# Altium schematic sheet Conn_B.SchDoc
size A1
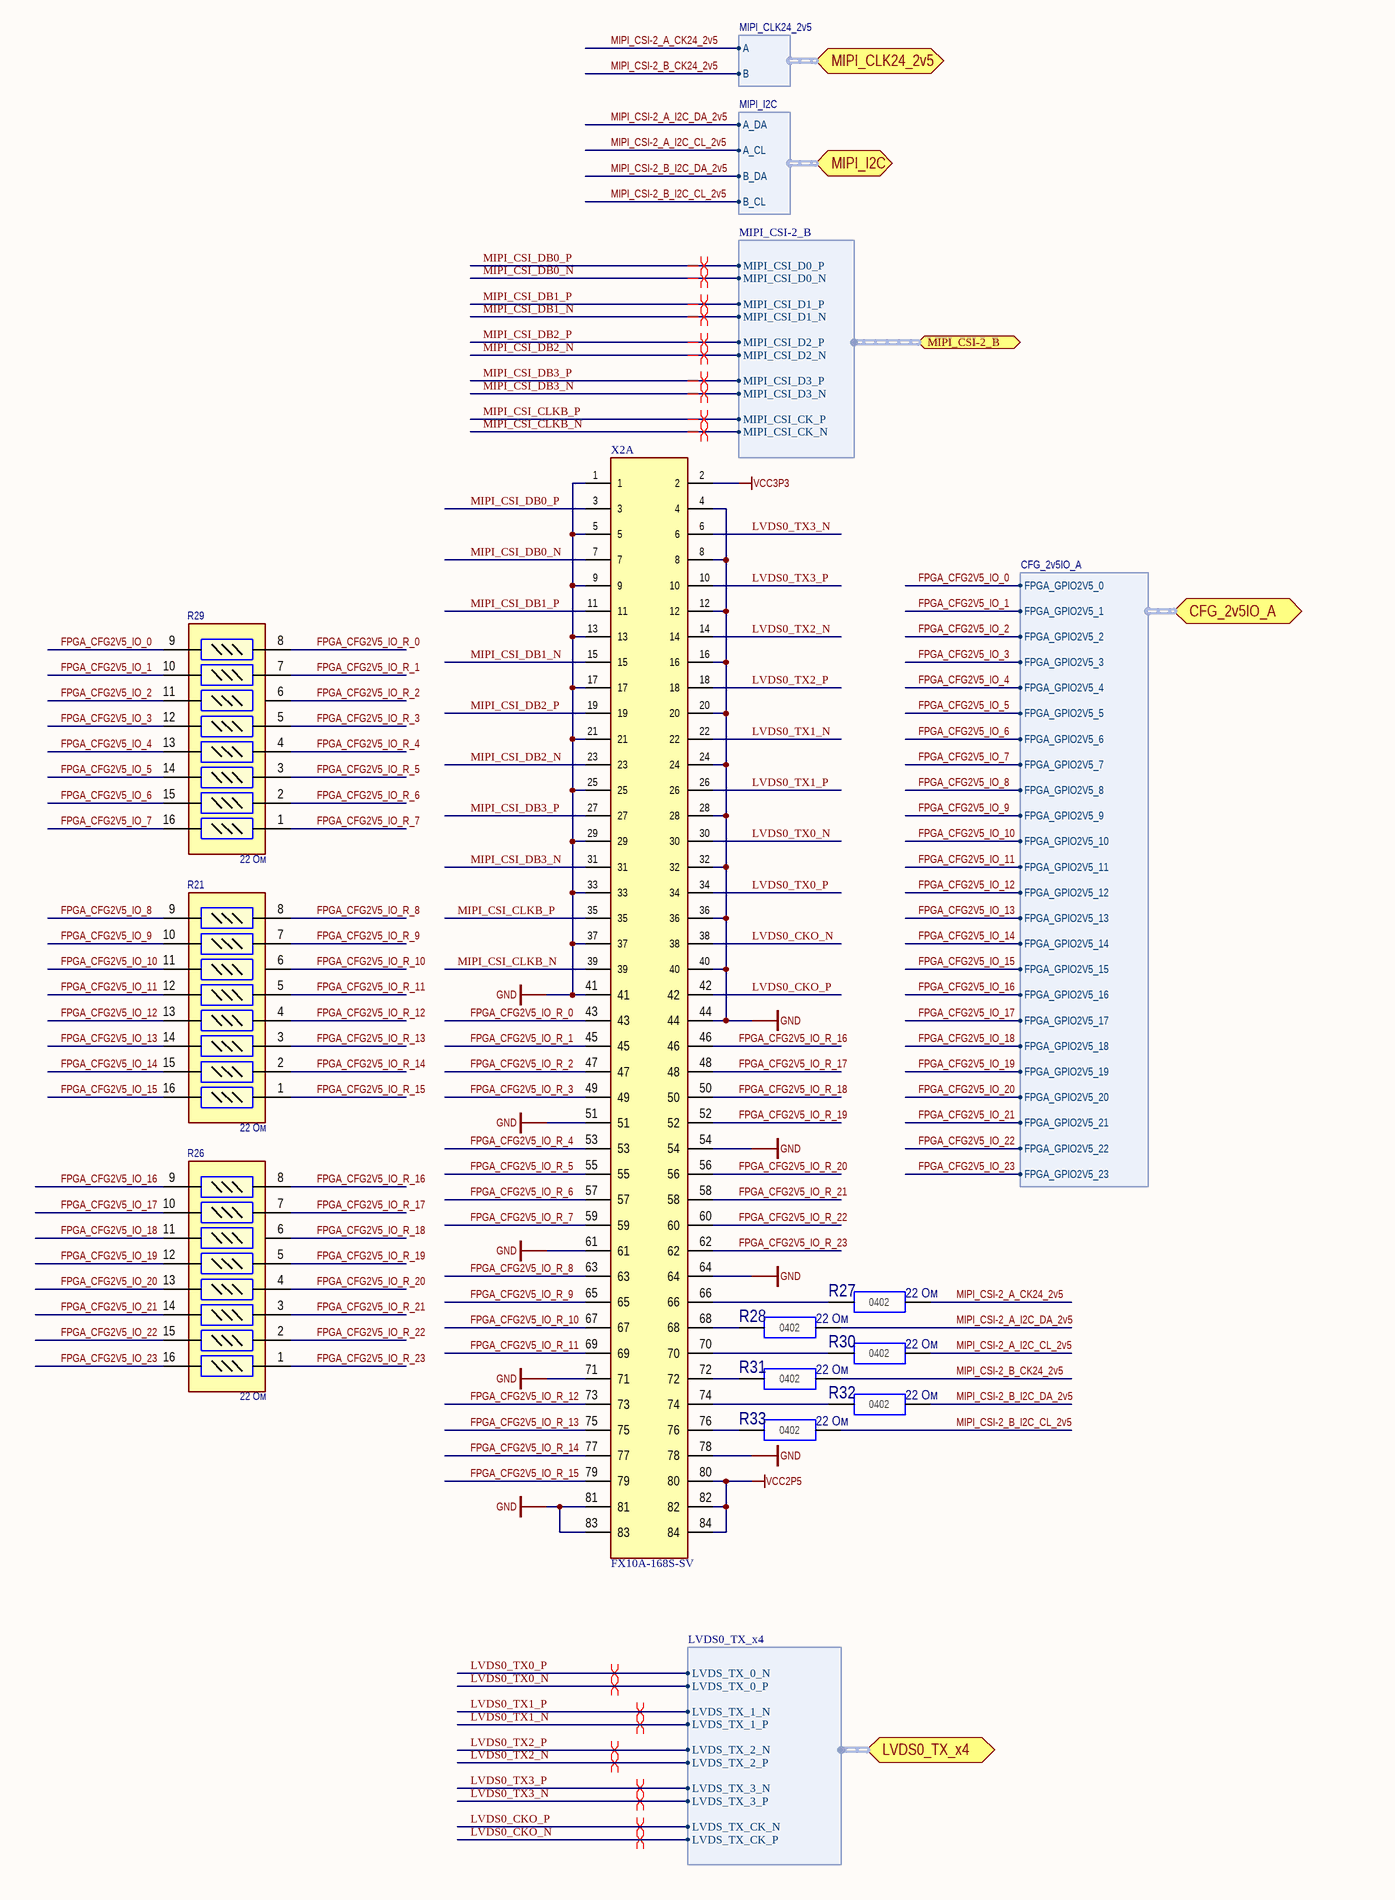
[diagram p0: Conn_B.SchDoc, left]
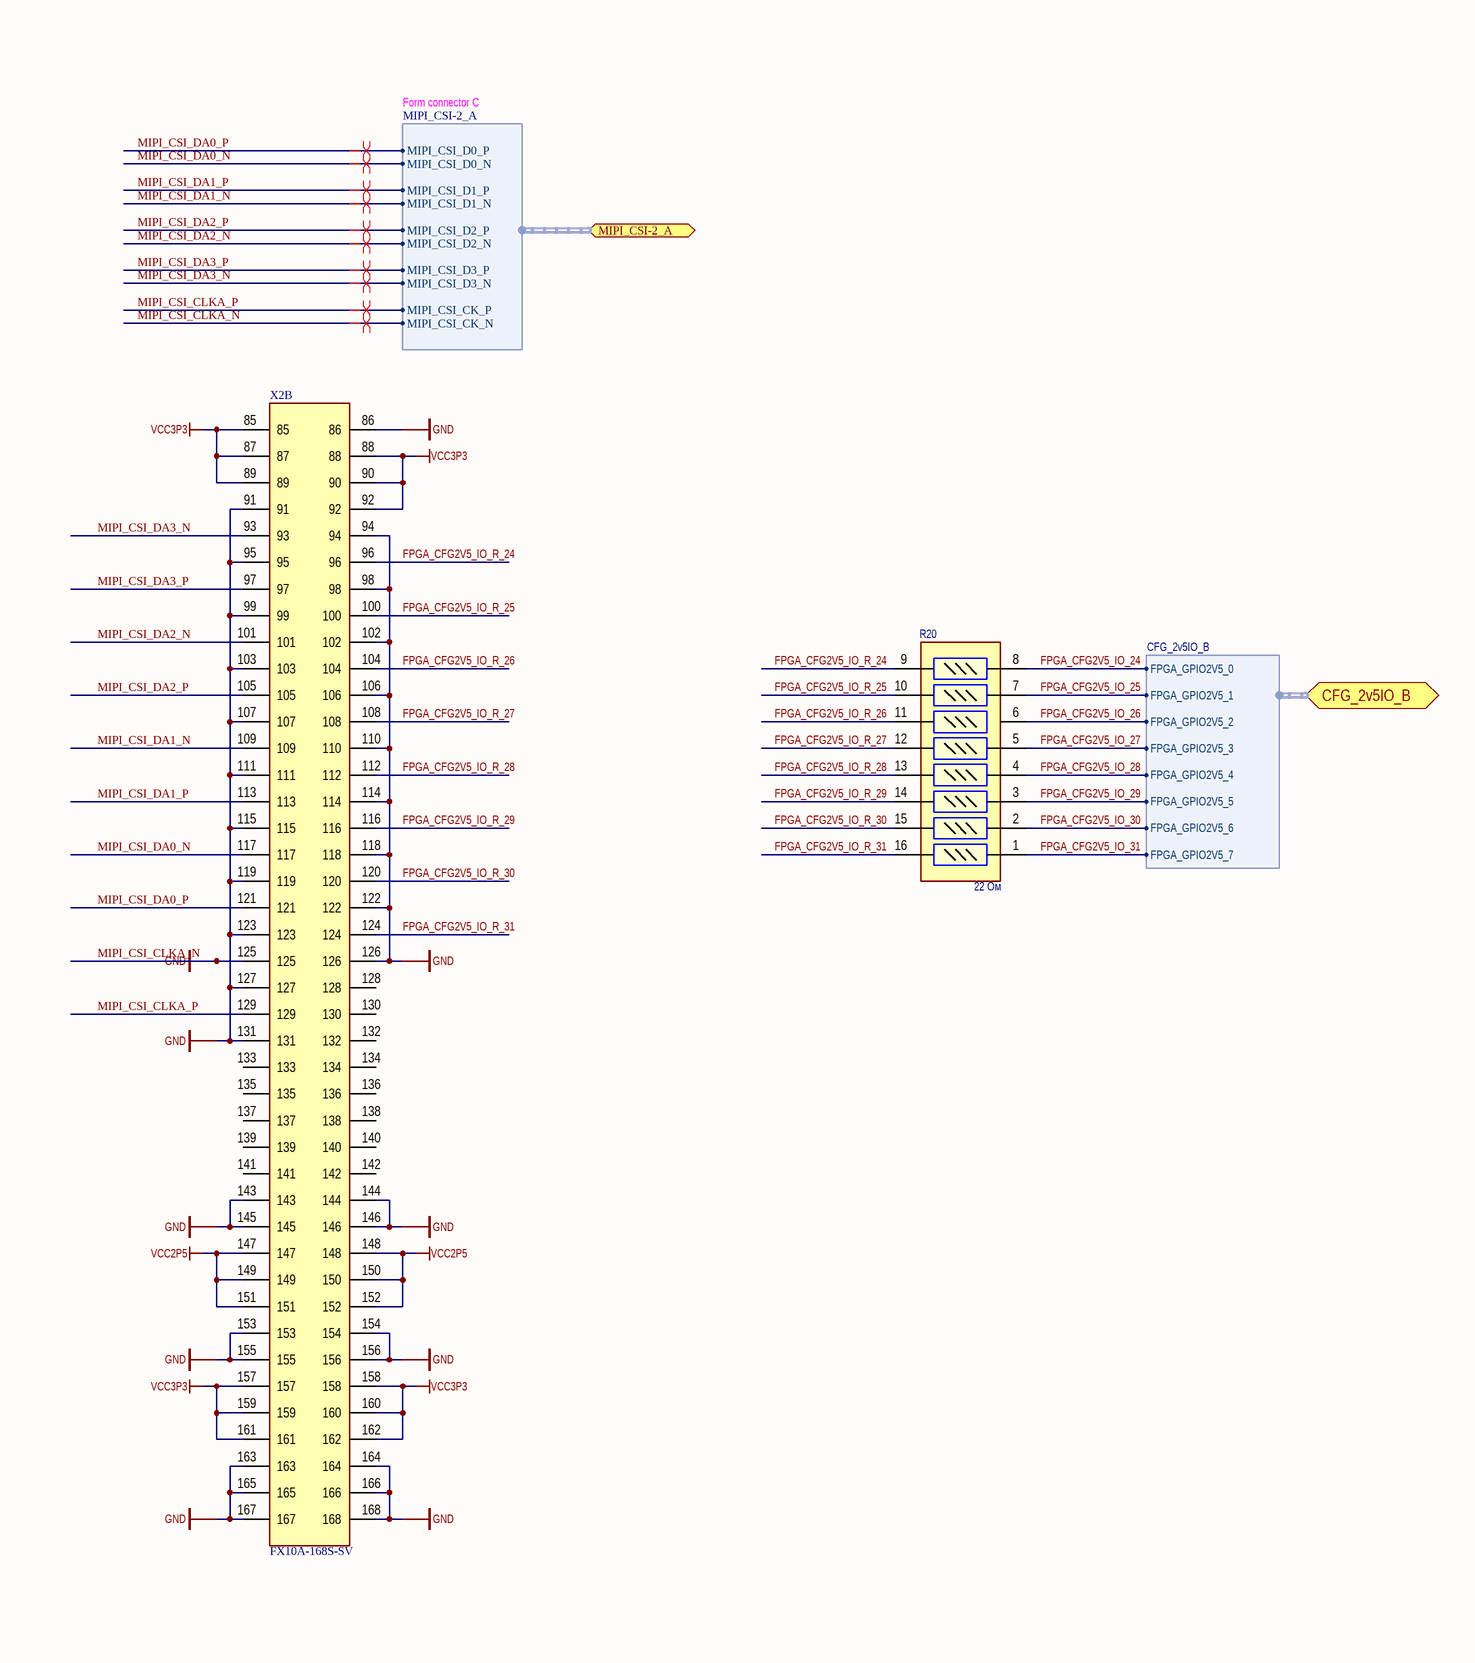
[diagram p1: Conn_B.SchDoc, right]

## Parts
R20  value 22 Ом  [CAT16-J8]  (hidden comment: YC248-JR-07-22 Ом)
R21  value 22 Ом  [CAT16-J8]  (hidden comment: YC248-JR-07-22 Ом)
R26  value 22 Ом  [CAT16-J8]  (hidden comment: YC248-JR-07-22 Ом)
R27  value 22 Ом  [CR0402(1005)]  (hidden comment: CR0402-22 Ом-±5%)
R28  value 22 Ом  [CR0402(1005)]  (hidden comment: CR0402-22 Ом-±5%)
R29  value 22 Ом  [CAT16-J8]  (hidden comment: YC248-JR-07-22 Ом)
R30  value 22 Ом  [CR0402(1005)]  (hidden comment: CR0402-22 Ом-±5%)
R31  value 22 Ом  [CR0402(1005)]  (hidden comment: CR0402-22 Ом-±5%)
R32  value 22 Ом  [CR0402(1005)]  (hidden comment: CR0402-22 Ом-±5%)
R33  value 22 Ом  [CR0402(1005)]  (hidden comment: CR0402-22 Ом-±5%)
X2  FX10A-168S-SV  [FX10A-168S-SV]  (parts A,B of 2)

## Ports
CFG_2v5IO_A (harness CFG_2v5IO_A), CFG_2v5IO_B (harness CFG_2v5IO_B), LVDS0_TX_x4 (harness LVDS0_TX_x4), MIPI_CLK24_2v5 (harness MIPI_CLK24_2v5), MIPI_CSI-2_A (harness MIPI_CSI-2_A), MIPI_CSI-2_B (harness MIPI_CSI-2_B), MIPI_I2C (harness MIPI_I2C)

## Harnesses
MIPI_CSI-2_A: MIPI_CSI_D0_N, MIPI_CSI_D0_P, MIPI_CSI_D1_N, MIPI_CSI_D1_P, MIPI_CSI_D2_P, MIPI_CSI_D2_N, MIPI_CSI_D3_N, MIPI_CSI_D3_P, MIPI_CSI_CK_N, MIPI_CSI_CK_P
MIPI_CSI-2_B: MIPI_CSI_D0_N, MIPI_CSI_D0_P, MIPI_CSI_D1_N, MIPI_CSI_D1_P, MIPI_CSI_D2_P, MIPI_CSI_D2_N, MIPI_CSI_D3_N, MIPI_CSI_D3_P, MIPI_CSI_CK_N, MIPI_CSI_CK_P
LVDS0_TX_x4: LVDS_TX_0_P, LVDS_TX_0_N, LVDS_TX_1_P, LVDS_TX_1_N, LVDS_TX_2_P, LVDS_TX_2_N, LVDS_TX_3_P, LVDS_TX_3_N, LVDS_TX_CK_P, LVDS_TX_CK_N
MIPI_CLK24_2v5: A, B
MIPI_I2C: A_DA, A_CL, B_DA, B_CL
CFG_2v5IO_A: FPGA_GPIO2V5_0, FPGA_GPIO2V5_1, FPGA_GPIO2V5_2, FPGA_GPIO2V5_3, FPGA_GPIO2V5_4, FPGA_GPIO2V5_5, FPGA_GPIO2V5_6, FPGA_GPIO2V5_7, FPGA_GPIO2V5_8, FPGA_GPIO2V5_9, FPGA_GPIO2V5_10, FPGA_GPIO2V5_11, FPGA_GPIO2V5_12, FPGA_GPIO2V5_13, FPGA_GPIO2V5_14, FPGA_GPIO2V5_15, FPGA_GPIO2V5_16, FPGA_GPIO2V5_17, FPGA_GPIO2V5_18, FPGA_GPIO2V5_19, FPGA_GPIO2V5_20, FPGA_GPIO2V5_21, FPGA_GPIO2V5_22, FPGA_GPIO2V5_23
CFG_2v5IO_B: FPGA_GPIO2V5_0, FPGA_GPIO2V5_1, FPGA_GPIO2V5_2, FPGA_GPIO2V5_3, FPGA_GPIO2V5_4, FPGA_GPIO2V5_5, FPGA_GPIO2V5_6, FPGA_GPIO2V5_7

## Nets
MIPI_CSI_CLKA_N: X2.1 X2.4 X2.5 X2.8 X2.9 X2.12 X2.13 X2.16 X2.17 X2.20 X2.21 X2.24 X2.25 X2.28 X2.29 X2.32 X2.33 X2.36 X2.37 X2.40 X2.41 X2.44 X2.51 X2.54 X2.61 X2.64 X2.71 X2.78 X2.81 X2.83 X2.86 X2.91 X2.94 X2.95 X2.98 X2.99 X2.102 X2.103 X2.106 X2.107 X2.110 X2.111 X2.114 X2.115 X2.118 X2.119 X2.122 X2.123 X2.125 X2.126 X2.127 X2.131 X2.143 X2.144 X2.145 X2.146 X2.153 X2.154 X2.155 X2.156 X2.163 X2.164 X2.165 X2.166 X2.167 X2.168 ; port MIPI_CSI-2_A.MIPI_CSI_CK_N  [also labelled GND]
VCC2P5: X2.80 X2.82 X2.84 X2.147 X2.148 X2.149 X2.150 X2.151 X2.152
VCC3P3: X2.2 X2.85 X2.87 X2.88 X2.89 X2.90 X2.92 X2.157 X2.158 X2.159 X2.160 X2.161 X2.162
FPGA_CFG2V5_IO_0: R29.9 ; port CFG_2v5IO_A.FPGA_GPIO2V5_0
FPGA_CFG2V5_IO_1: R29.10 ; port CFG_2v5IO_A.FPGA_GPIO2V5_1
FPGA_CFG2V5_IO_2: R29.11 ; port CFG_2v5IO_A.FPGA_GPIO2V5_2
FPGA_CFG2V5_IO_3: R29.12 ; port CFG_2v5IO_A.FPGA_GPIO2V5_3
FPGA_CFG2V5_IO_4: R29.13 ; port CFG_2v5IO_A.FPGA_GPIO2V5_4
FPGA_CFG2V5_IO_5: R29.14 ; port CFG_2v5IO_A.FPGA_GPIO2V5_5
FPGA_CFG2V5_IO_6: R29.15 ; port CFG_2v5IO_A.FPGA_GPIO2V5_6
FPGA_CFG2V5_IO_7: R29.16 ; port CFG_2v5IO_A.FPGA_GPIO2V5_7
FPGA_CFG2V5_IO_8: R21.9 ; port CFG_2v5IO_A.FPGA_GPIO2V5_8
FPGA_CFG2V5_IO_9: R21.10 ; port CFG_2v5IO_A.FPGA_GPIO2V5_9
FPGA_CFG2V5_IO_10: R21.11 ; port CFG_2v5IO_A.FPGA_GPIO2V5_10
FPGA_CFG2V5_IO_11: R21.12 ; port CFG_2v5IO_A.FPGA_GPIO2V5_11
FPGA_CFG2V5_IO_12: R21.13 ; port CFG_2v5IO_A.FPGA_GPIO2V5_12
FPGA_CFG2V5_IO_13: R21.14 ; port CFG_2v5IO_A.FPGA_GPIO2V5_13
FPGA_CFG2V5_IO_14: R21.15 ; port CFG_2v5IO_A.FPGA_GPIO2V5_14
FPGA_CFG2V5_IO_15: R21.16 ; port CFG_2v5IO_A.FPGA_GPIO2V5_15
FPGA_CFG2V5_IO_16: R26.9 ; port CFG_2v5IO_A.FPGA_GPIO2V5_16
FPGA_CFG2V5_IO_17: R26.10 ; port CFG_2v5IO_A.FPGA_GPIO2V5_17
FPGA_CFG2V5_IO_18: R26.11 ; port CFG_2v5IO_A.FPGA_GPIO2V5_18
FPGA_CFG2V5_IO_19: R26.12 ; port CFG_2v5IO_A.FPGA_GPIO2V5_19
FPGA_CFG2V5_IO_20: R26.13 ; port CFG_2v5IO_A.FPGA_GPIO2V5_20
FPGA_CFG2V5_IO_21: R26.14 ; port CFG_2v5IO_A.FPGA_GPIO2V5_21
FPGA_CFG2V5_IO_22: R26.15 ; port CFG_2v5IO_A.FPGA_GPIO2V5_22
FPGA_CFG2V5_IO_23: R26.16 ; port CFG_2v5IO_A.FPGA_GPIO2V5_23
FPGA_CFG2V5_IO_24: R20.8 ; port CFG_2v5IO_B.FPGA_GPIO2V5_0
FPGA_CFG2V5_IO_25: R20.7 ; port CFG_2v5IO_B.FPGA_GPIO2V5_1
FPGA_CFG2V5_IO_26: R20.6 ; port CFG_2v5IO_B.FPGA_GPIO2V5_2
FPGA_CFG2V5_IO_27: R20.5 ; port CFG_2v5IO_B.FPGA_GPIO2V5_3
FPGA_CFG2V5_IO_28: R20.4 ; port CFG_2v5IO_B.FPGA_GPIO2V5_4
FPGA_CFG2V5_IO_29: R20.3 ; port CFG_2v5IO_B.FPGA_GPIO2V5_5
FPGA_CFG2V5_IO_30: R20.2 ; port CFG_2v5IO_B.FPGA_GPIO2V5_6
FPGA_CFG2V5_IO_31: R20.1 ; port CFG_2v5IO_B.FPGA_GPIO2V5_7
FPGA_CFG2V5_IO_R_0: R29.8 X2.43
FPGA_CFG2V5_IO_R_1: R29.7 X2.45
FPGA_CFG2V5_IO_R_2: R29.6 X2.47
FPGA_CFG2V5_IO_R_3: R29.5 X2.49
FPGA_CFG2V5_IO_R_4: R29.4 X2.53
FPGA_CFG2V5_IO_R_5: R29.3 X2.55
FPGA_CFG2V5_IO_R_6: R29.2 X2.57
FPGA_CFG2V5_IO_R_7: R29.1 X2.59
FPGA_CFG2V5_IO_R_8: R21.8 X2.63
FPGA_CFG2V5_IO_R_9: R21.7 X2.65
FPGA_CFG2V5_IO_R_10: R21.6 X2.67
FPGA_CFG2V5_IO_R_11: R21.5 X2.69
FPGA_CFG2V5_IO_R_12: R21.4 X2.73
FPGA_CFG2V5_IO_R_13: R21.3 X2.75
FPGA_CFG2V5_IO_R_14: R21.2 X2.77
FPGA_CFG2V5_IO_R_15: R21.1 X2.79
FPGA_CFG2V5_IO_R_16: R26.8 X2.46
FPGA_CFG2V5_IO_R_17: R26.7 X2.48
FPGA_CFG2V5_IO_R_18: R26.6 X2.50
FPGA_CFG2V5_IO_R_19: R26.5 X2.52
FPGA_CFG2V5_IO_R_20: R26.4 X2.56
FPGA_CFG2V5_IO_R_21: R26.3 X2.58
FPGA_CFG2V5_IO_R_22: R26.2 X2.60
FPGA_CFG2V5_IO_R_23: R26.1 X2.62
FPGA_CFG2V5_IO_R_24: R20.9 X2.96
FPGA_CFG2V5_IO_R_25: R20.10 X2.100
FPGA_CFG2V5_IO_R_26: R20.11 X2.104
FPGA_CFG2V5_IO_R_27: R20.12 X2.108
FPGA_CFG2V5_IO_R_28: R20.13 X2.112
FPGA_CFG2V5_IO_R_29: R20.14 X2.116
FPGA_CFG2V5_IO_R_30: R20.15 X2.120
FPGA_CFG2V5_IO_R_31: R20.16 X2.124
LVDS0_CKO_N: X2.38 ; port LVDS0_TX_x4.LVDS_TX_CK_P
LVDS0_CKO_P: X2.42 ; port LVDS0_TX_x4.LVDS_TX_CK_N
LVDS0_TX0_N: X2.30 ; port LVDS0_TX_x4.LVDS_TX_0_P
LVDS0_TX0_P: X2.34 ; port LVDS0_TX_x4.LVDS_TX_0_N
LVDS0_TX1_N: X2.22 ; port LVDS0_TX_x4.LVDS_TX_1_P
LVDS0_TX1_P: X2.26 ; port LVDS0_TX_x4.LVDS_TX_1_N
LVDS0_TX2_N: X2.14 ; port LVDS0_TX_x4.LVDS_TX_2_P
LVDS0_TX2_P: X2.18 ; port LVDS0_TX_x4.LVDS_TX_2_N
LVDS0_TX3_N: X2.6 ; port LVDS0_TX_x4.LVDS_TX_3_P
LVDS0_TX3_P: X2.10 ; port LVDS0_TX_x4.LVDS_TX_3_N
MIPI_CSI-2_A_CK24_2v5: R27.2(-) ; port MIPI_CLK24_2v5.A
MIPI_CSI-2_A_I2C_CL_2v5: R30.2(-) ; port MIPI_I2C.A_CL
MIPI_CSI-2_A_I2C_DA_2v5: R28.2(-) ; port MIPI_I2C.A_DA
MIPI_CSI-2_B_CK24_2v5: R31.2(-) ; port MIPI_CLK24_2v5.B
MIPI_CSI-2_B_I2C_CL_2v5: R33.2(-) ; port MIPI_I2C.B_CL
MIPI_CSI-2_B_I2C_DA_2v5: R32.2(-) ; port MIPI_I2C.B_DA
MIPI_CSI_CLKA_P: X2.129 ; port MIPI_CSI-2_A.MIPI_CSI_CK_P
MIPI_CSI_CLKB_N: X2.39 ; port MIPI_CSI-2_B.MIPI_CSI_CK_N
MIPI_CSI_CLKB_P: X2.35 ; port MIPI_CSI-2_B.MIPI_CSI_CK_P
MIPI_CSI_DA0_N: X2.117 ; port MIPI_CSI-2_A.MIPI_CSI_D0_N
MIPI_CSI_DA0_P: X2.121 ; port MIPI_CSI-2_A.MIPI_CSI_D0_P
MIPI_CSI_DA1_N: X2.109 ; port MIPI_CSI-2_A.MIPI_CSI_D1_N
MIPI_CSI_DA1_P: X2.113 ; port MIPI_CSI-2_A.MIPI_CSI_D1_P
MIPI_CSI_DA2_N: X2.101 ; port MIPI_CSI-2_A.MIPI_CSI_D2_N
MIPI_CSI_DA2_P: X2.105 ; port MIPI_CSI-2_A.MIPI_CSI_D2_P
MIPI_CSI_DA3_N: X2.93 ; port MIPI_CSI-2_A.MIPI_CSI_D3_N
MIPI_CSI_DA3_P: X2.97 ; port MIPI_CSI-2_A.MIPI_CSI_D3_P
MIPI_CSI_DB0_N: X2.7 ; port MIPI_CSI-2_B.MIPI_CSI_D0_N
MIPI_CSI_DB0_P: X2.3 ; port MIPI_CSI-2_B.MIPI_CSI_D0_P
MIPI_CSI_DB1_N: X2.15 ; port MIPI_CSI-2_B.MIPI_CSI_D1_N
MIPI_CSI_DB1_P: X2.11 ; port MIPI_CSI-2_B.MIPI_CSI_D1_P
MIPI_CSI_DB2_N: X2.23 ; port MIPI_CSI-2_B.MIPI_CSI_D2_N
MIPI_CSI_DB2_P: X2.19 ; port MIPI_CSI-2_B.MIPI_CSI_D2_P
MIPI_CSI_DB3_N: X2.31 ; port MIPI_CSI-2_B.MIPI_CSI_D3_N
MIPI_CSI_DB3_P: X2.27 ; port MIPI_CSI-2_B.MIPI_CSI_D3_P
NetR27_1: R27.1(+) X2.66
NetR28_1: R28.1(+) X2.68
NetR30_1: R30.1(+) X2.70
NetR31_1: R31.1(+) X2.72
NetR32_1: R32.1(+) X2.74
NetR33_1: R33.1(+) X2.76

Not connected (* = marked no-connect by the designer): X2 128 130 132 133 134 135 136 137 138 139 140 141 142

## Layout directives
differential pair: LVDS0_CKO_N, LVDS0_CKO_P, LVDS0_TX0_N, LVDS0_TX0_P, LVDS0_TX1_N, LVDS0_TX1_P, LVDS0_TX2_N, LVDS0_TX2_P, LVDS0_TX3_N, LVDS0_TX3_P, MIPI_CSI_CLKA_N, MIPI_CSI_CLKA_P, MIPI_CSI_CLKB_N, MIPI_CSI_CLKB_P, MIPI_CSI_DA0_N, MIPI_CSI_DA0_P, MIPI_CSI_DA1_N, MIPI_CSI_DA1_P, MIPI_CSI_DA2_N, MIPI_CSI_DA2_P, MIPI_CSI_DA3_N, MIPI_CSI_DA3_P, MIPI_CSI_DB0_N, MIPI_CSI_DB0_P, MIPI_CSI_DB1_N, MIPI_CSI_DB1_P, MIPI_CSI_DB2_N, MIPI_CSI_DB2_P, MIPI_CSI_DB3_N, MIPI_CSI_DB3_P

## Notes on the sheet
- Form connector C
- (in symbol CR0402-#-±5%) 0402

## Library data of the parts
R20 R21 R26 R29 = YC248-JR-07-#: Набор чип резисторов; P: 0.062 Вт; Supplier 1: Digi-Key; Supplier Part Number 1: YC248-JR-0722RL
R27 R28 R30-R33 = CR0402-#-±5%: Чип резистор; Maximum Working Voltage: 50 В; TOLERANCE: 5%; Supplier 1: Digi-Key; Supplier Part Number 1: 311-10.0KLRDKR-ND